# EAGLE design konektor_1 (EAGLE 6.3)
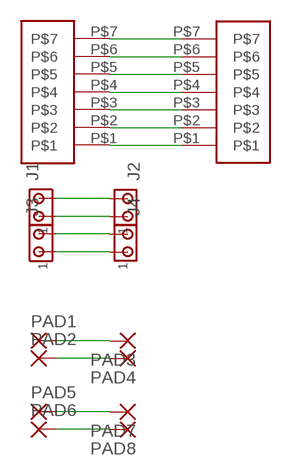
[diagram p0: schematic, sheet 1]

## Parts
J1  MTA02-100  [10X02MTA]
J2  MTA02-100  [10X02MTA]
J3  MTA02-100  [10X02MTA]
J4  MTA02-100  [10X02MTA]
PAD1  2,54/0,8  [2,54/0,8]
PAD2  2,54/0,8  [2,54/0,8]
PAD3  2,54/0,8  [2,54/0,8]
PAD4  2,54/0,8  [2,54/0,8]
PAD5  2,54/0,8  [2,54/0,8]
PAD6  2,54/0,8  [2,54/0,8]
PAD7  2,54/0,8  [2,54/0,8]
PAD8  2,54/0,8  [2,54/0,8]
U$1  7PIN  [7PIN]
U$2  7PIN  [7PIN]

## Nets
N$1: J3.1 J4.1
N$2: J3.2 J4.2
N$3: U$1.P$6 U$2.P$6
N$4: U$1.P$5 U$2.P$5
N$5: U$1.P$4 U$2.P$4
N$6: U$1.P$3 U$2.P$3
N$7: U$1.P$2 U$2.P$2
N$8: U$1.P$1 U$2.P$1
N$9: U$1.P$7 U$2.P$7
N$10: J1.1 J2.1
N$11: J1.2 J2.2
N$12: PAD1.1(P) PAD3.1(P)
N$13: PAD2.1(P) PAD4.1(P)
N$14: PAD5.1(P) PAD7.1(P)
N$15: PAD6.1(P) PAD8.1(P)

## Library data of the parts
J1-J4 = con-amp:MTA02-100: AMP connector
PAD1-PAD8 = wirepad:2,54/0,8: THROUGH-HOLE PAD
U$1 U$2 = ref-packages:7PIN

## Board
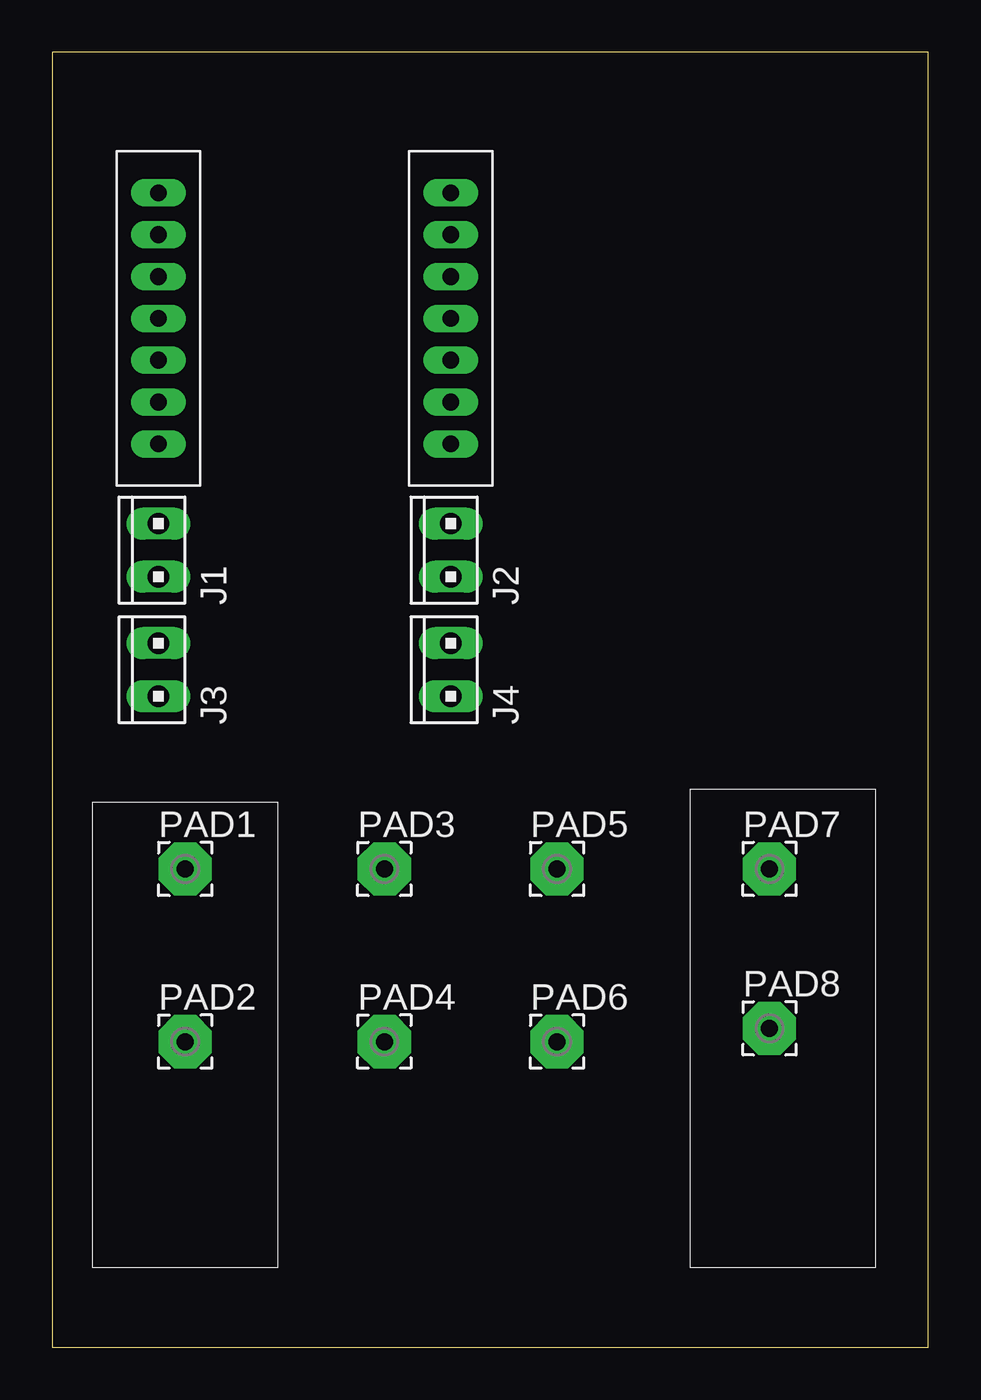
[diagram p1: board, top side]
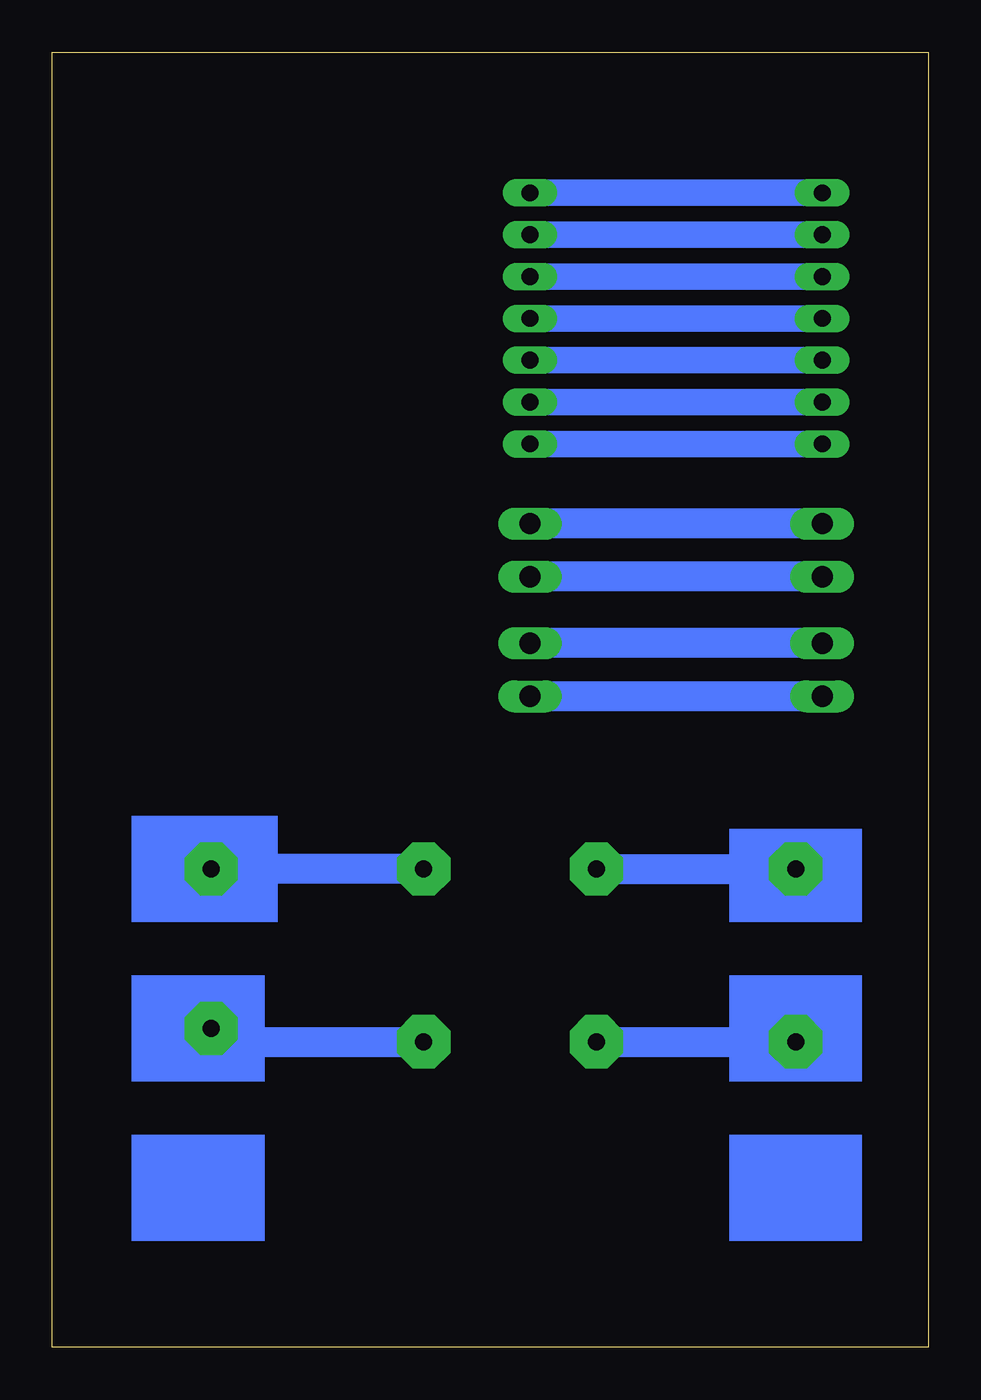
[diagram p2: board, bottom side, seen from below]

Size 41.89 x 61.9 mm. Coordinates in mm from the lower left corner, seen from the top.
Outline: 0,0 41.89,0 41.89,61.9 0,61.9 0,0
Copper layers (1*16): Top 0.035mm / dielectric 1.5mm / Bottom 0.035mm
Design rules "default": minimum track width 10mil, minimum drill 24mil, track to track 8mil, track to pad 8mil, pad to pad 8mil, via to via 8mil, smd to smd 8mil, copper to edge 40mil, drill to drill 8mil, minimum pad ring 10mil, minimum via ring 8mil, stop-mask expansion 4mil, vias tented up to drill 0mil, thermal gap 10mil

### Footprints (pad centres in the part's own frame; a part is rotated, then mirrored left to right if it is on the bottom)
10X02MTA = drill 1.016 long: 1 1.27,0; 2 -1.27,0
2,54/0,8 = drill 0.813 pad 2.54 octagon: 1 0,0
7PIN = drill 0.8 long: P$1 0,0; P$2 2,0; P$3 4,0; P$4 6,0; P$5 8,0; P$6 10,0; P$7 12,0

### Placement (x,y rotation side)
J1  5.08,38.1 90 top
J2  19.05,38.1 90 top
J3  5.08,32.38 90 top
J4  19.05,32.38 90 top
PAD1  6.35,22.86 0 top
PAD2  6.35,14.61 0 top
PAD3  15.88,22.86 0 top
PAD4  15.88,14.61 0 top
PAD5  24.13,22.86 0 top
PAD6  24.13,14.61 0 top
PAD7  34.29,22.86 0 top
PAD8  34.29,15.24 0 top
U$1  19.05,43.18 90 top
U$2  5.08,43.18 90 top

### Tracks (layer width: path | path; a pad name or v marks a point on that pad's centre or on a via)
N$1
  Bottom 1.422: J3.1 J4.1
N$2
  Bottom 1.422: J3.2 J4.2
N$3
  Bottom 1.27: U$1.P$6 U$2.P$6
N$4
  Bottom 1.27: U$1.P$5 U$2.P$5
N$5
  Bottom 1.27: U$2.P$4 U$1.P$4
N$6
  Bottom 1.27: U$2.P$3 U$1.P$3
N$7
  Bottom 1.27: U$1.P$2 U$2.P$2
N$8
  Bottom 1.27: U$2.P$1 U$1.P$1
N$9
  Bottom 1.27: U$2.P$7 U$1.P$7
N$10
  Bottom 1.422: J1.1 J2.1
N$11
  Bottom 1.422: J1.2 J2.2
N$12
  Bottom 1.422: PAD3.1 PAD1.1
N$13
  Bottom 1.422: PAD4.1 PAD2.1
N$14
  Bottom 0.813: 35.56,22.86 PAD7.1
  Bottom 1.422: PAD5.1 PAD7.1
N$15
  Bottom 1.422: PAD8.1 34.29,14.61 PAD6.1
(copper drawn outside any net)
  shapes: Bottom area x6